# Altium schematic sheet Controller.SchDoc: Schema MPC 555
size A4; Organization1: Sciences of Technology Buchs; Size: A4
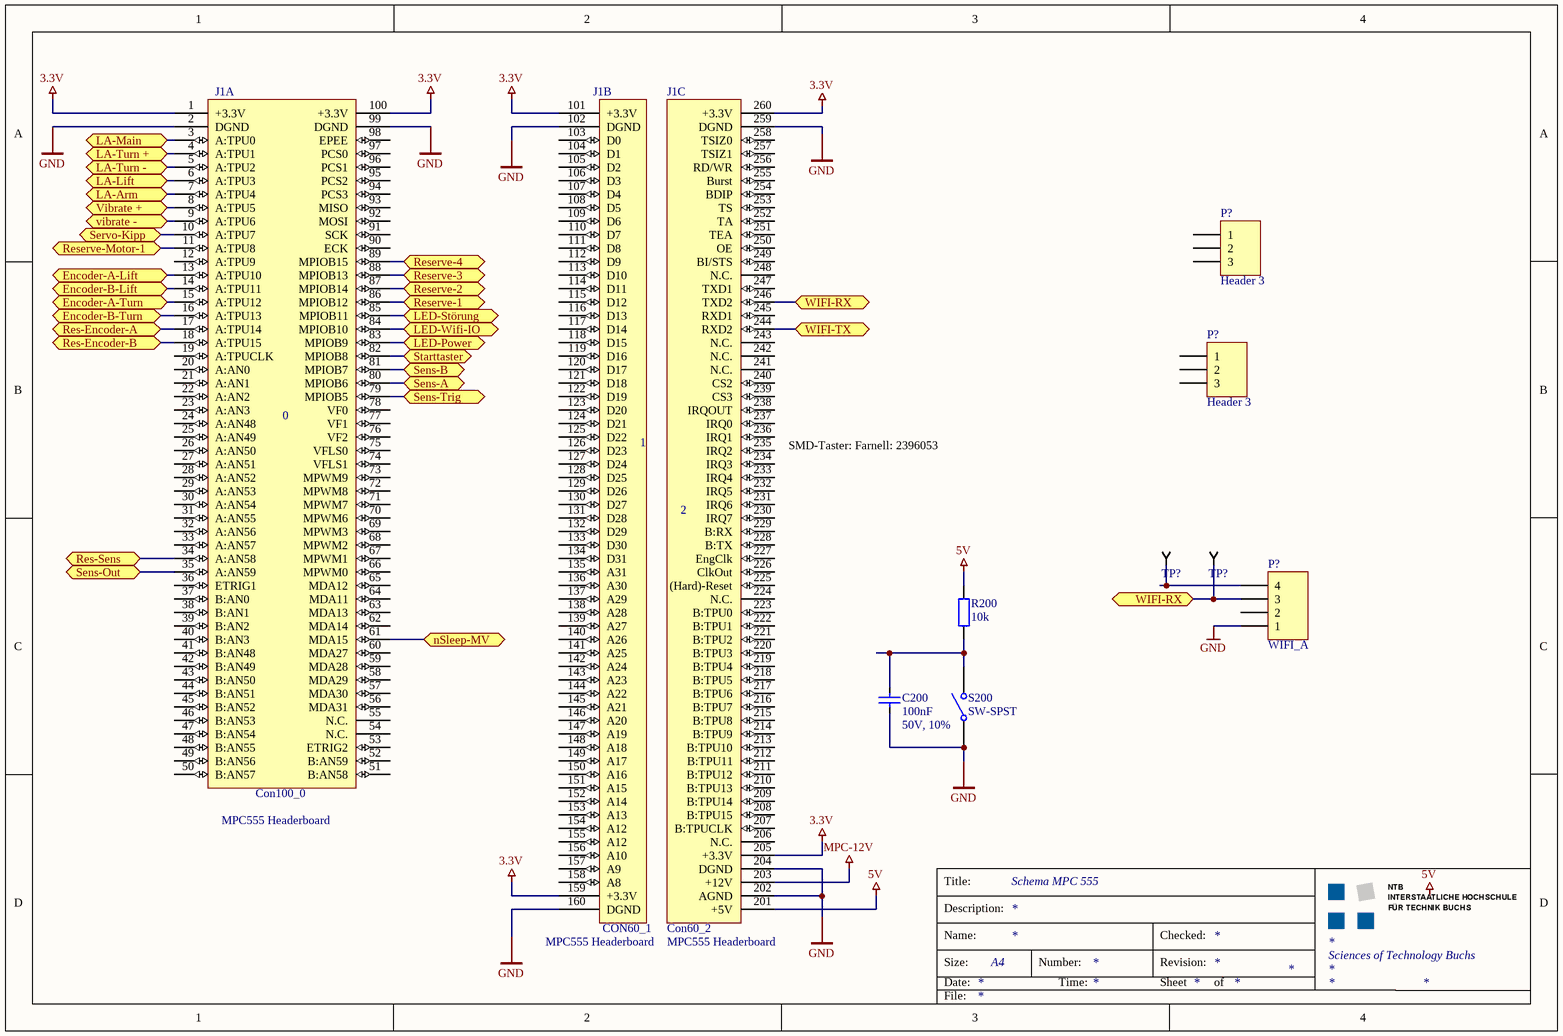
[diagram p0: Controller.SchDoc]

## Parts
(Parts that share a designator on the sheet are numbered #1, #2 ... from top to bottom, then left to right.)
C200  100nF  ValAddon: 50V, 10%  [CAP-0805[2012]]
J1  MPC555 Headerboard  [MPC555 Headerboard THT]  (parts A,B,C of 3)
P?#1  Header 3  [HDR1X3]
P?#2  Header 3  [HDR1X3]
P?#3  WIFI_A  [HDR1X4]
R200  10k  [RES-0805[2012]]
S200  SW-SPST  [B3SE-1002P]
TP?#1  Testpoint SMD 1206  [TP-SMD-1206]  (value not drawn)  (no BOM)
TP?#2  Testpoint SMD 1206  [TP-SMD-1206]  (value not drawn)  (no BOM)

## Ports
Encoder-A-Lift (bidir), Encoder-A-Turn (bidir), Encoder-B-Lift (bidir), Encoder-B-Turn (bidir), LA-Arm (bidir), LA-Lift (bidir), LA-Main (bidir), LA-Turn + (bidir), LA-Turn -, LED-Power (bidir), LED-Störung (bidir), LED-Wifi-IO (bidir), nSleep-MV (bidir), Res-Encoder-A (bidir), Res-Encoder-B (bidir), Res-Sens (bidir), Reserve-1 (bidir), Reserve-2 (bidir), Reserve-3 (bidir), Reserve-4 (bidir), Reserve-Motor-1 (bidir), Sens-A (bidir), Sens-B (bidir), Sens-Out (bidir), Sens-Trig (bidir), Servo-Kipp (bidir), Starttaster (bidir), Vibrate + (bidir), vibrate - (bidir), WIFI-RX (bidir), WIFI-TX (bidir)

## Nets
3.3V: J1.1(+3.3V) J1.100(+3.3V) J1.101(+3.3V) J1.159(+3.3V) J1.205(+3.3V) J1.260(+3.3V)
5V: J1.201(+5V) R200.2
GND: C200.2(Neg) J1.2(DGND) J1.99(DGND) J1.102(DGND) J1.160(DGND) J1.202(AGND) J1.204(DGND) J1.259(DGND) P?#3.1 S200.1(COMMON)
MPC-12V: J1.203(+12V)
Encoder-A-Lift: J1.13(A:TPU10) ; port Encoder-A-Lift
Encoder-A-Turn: J1.15(A:TPU12) ; port Encoder-A-Turn
Encoder-B-Lift: J1.14(A:TPU11) ; port Encoder-B-Lift
Encoder-B-Turn: J1.16(A:TPU13) ; port Encoder-B-Turn
LA-Arm: J1.7(A:TPU4) ; port LA-Arm
LA-Lift: J1.6(A:TPU3) ; port LA-Lift
LA-Main: J1.3(A:TPU0) ; port LA-Main
LA-Turn +: J1.4(A:TPU1) ; port LA-Turn +
LA-Turn -: J1.5(A:TPU2) ; port LA-Turn -
LED-Power: J1.83(MPIOB9) ; port LED-Power
LED-Störung: J1.85(MPIOB11) ; port LED-Störung
LED-Wifi-IO: J1.84(MPIOB10) ; port LED-Wifi-IO
nSleep-MV: J1.61(MDA15) ; port nSleep-MV
Res-Encoder-A: J1.17(A:TPU14) ; port Res-Encoder-A
Res-Encoder-B: J1.18(A:TPU15) ; port Res-Encoder-B
Res-Sens: J1.34(A:AN58) ; port Res-Sens
Reserve-1: J1.86(MPIOB12) ; port Reserve-1
Reserve-2: J1.87(MPIOB14) ; port Reserve-2
Reserve-3: J1.88(MPIOB13) ; port Reserve-3
Reserve-4: J1.89(MPIOB15) ; port Reserve-4
Reserve-Motor-1: J1.11(A:TPU8) ; port Reserve-Motor-1
Sens-A: J1.80(MPIOB6) ; port Sens-A
Sens-B: J1.81(MPIOB7) ; port Sens-B
Sens-Out: J1.35(A:AN59) ; port Sens-Out
Sens-Trig: J1.79(MPIOB5) ; port Sens-Trig
Servo-Kipp: J1.10(A:TPU7) ; port Servo-Kipp
Starttaster: J1.82(MPIOB8) ; port Starttaster
Vibrate +: J1.8(A:TPU5) ; port Vibrate +
vibrate -: J1.9(A:TPU6) ; port vibrate -
WIFI-RX: J1.246(TXD2) P?#3.3 TP?#2.1 ; port WIFI-RX
WIFI-TX: J1.244(RXD2) ; port WIFI-TX
NetC200_1: C200.1(Pos) R200.1 S200.2(NO)
NetP?#3_4: P?#3.4 TP?#1.1

Not connected (* = marked no-connect by the designer): J1 12(A:TPU9) 19(A:TPUCLK) 20(A:AN0) 21(A:AN1) 22(A:AN2) 23(A:AN3) 24(A:AN48) 25(A:AN49) 26(A:AN50) 27(A:AN51) 28(A:AN52) 29(A:AN53) 30(A:AN54) 31(A:AN55) 32(A:AN56) 33(A:AN57) 36(ETRIG1) 37(B:AN0) 38(B:AN1) 39(B:AN2) 40(B:AN3) 41(B:AN48) 42(B:AN49) 43(B:AN50) 44(B:AN51) 45(B:AN52) 46(B:AN53) 47(B:AN54) 48(B:AN55) 49(B:AN56) 50(B:AN57) 51(B:AN58) 52(B:AN59) 53(ETRIG2) 54(N.C.) 55(N.C.) 56(MDA31) 57(MDA30) 58(MDA29) 59(MDA28) 60(MDA27) 62(MDA14) 63(MDA13) 64(MDA11) 65(MDA12) 66(MPWM0) 67(MPWM1) 68(MPWM2) 69(MPWM3) 70(MPWM6) 71(MPWM7) 72(MPWM8) 73(MPWM9) 74(VFLS1) 75(VFLS0) 76(VF2) 77(VF1) 78(VF0) 90(ECK) 91(SCK) 92(MOSI) 93(MISO) 94(PCS3) 95(PCS2) 96(PCS1) 97(PCS0) 98(EPEE) 103(D0) 104(D1) 105(D2) 106(D3) 107(D4) 108(D5) 109(D6) 110(D7) 111(D8) 112(D9) 113(D10) 114(D11) 115(D12) 116(D13) 117(D14) 118(D15) 119(D16) 120(D17) 121(D18) 122(D19) 123(D20) 124(D21) 125(D22) 126(D23) 127(D24) 128(D25) 129(D26) 130(D27) 131(D28) 132(D29) 133(D30) 134(D31) 135(A31) 136(A30) 137(A29) 138(A28) 139(A27) 140(A26) 141(A25) 142(A24) 143(A23) 144(A22) 145(A21) 146(A20) 147(A19) 148(A18) 149(A17) 150(A16) 151(A15) 152(A14) 153(A13) 154(A12) 155(A12) 156(A10) 157(A9) 158(A8) 206(N.C.) 207(B:TPUCLK) 208(B:TPU15) 209(B:TPU14) 210(B:TPU13) 211(B:TPU12) 212(B:TPU11) 213(B:TPU10) 214(B:TPU9) 215(B:TPU8) 216(B:TPU7) 217(B:TPU6) 218(B:TPU5) 219(B:TPU4) 220(B:TPU3) 221(B:TPU2) 222(B:TPU1) 223(B:TPU0) 224(N.C.) 225((Hard)-Reset) 226(ClkOut) 227(EngClk) 228(B:TX) 229(B:RX) 230(IRQ7) 231(IRQ6) 232(IRQ5) 233(IRQ4) 234(IRQ3) 235(IRQ2) 236(IRQ1) 237(IRQ0) 238(IRQOUT) 239(CS3) 240(CS2) 241(N.C.) 242(N.C.) 243(N.C.) 245(RXD1) 247(TXD1) 248(N.C.) 249(BI/STS) 250(OE) 251(TEA) 252(TA) 253(TS) 254(BDIP) 255(Burst) 256(RD/WR) 257(TSIZ1) 258(TSIZ0); P?#1 1 2 3; P?#2 1 2 3; P?#3 2

## Notes on the sheet
- (near J1) SMD-Taster: Farnell: 2396053
- Labels drawn without touching a wire or pin: 5V
- Title:
- Description:
- Size:
- Date:
- Name:
- Number:
- Time:
- Revision:
- Sheet
- Checked:
- of
- File:
- (in symbol MPC555 Headerboard, part A) 0; Con100_0
- (in symbol MPC555 Headerboard, part B) CON60_1
- (in symbol MPC555 Headerboard, part C) Con60_2

## Library data of the parts
C200 = MLCC 0805 100n 50V: 100n 50V X7R MLCC 0805 (1608 Metric); Tolerance: 10%; Case-EIA: 0803; Case-Metric: 2013; Rated Voltage: 50V; Temperature Characteristics EIA: X7R; Temperature Range EIA: -55C/+125C; Value: 100nF
J1 = MPC555 Headerboard: NTB MPC555 Headerboard
P?#1 P?#2 = Header 3: Header, 3-Pin; LatestRevisionDate: 17-Jul-2002; LatestRevisionNote: Re-released for DXP Platform.; Publisher: Altium Limited
P?#3 = Header 4: Header, 4-Pin; LatestRevisionDate: 17-Jul-2002; LatestRevisionNote: Re-released for DXP Platform.; Publisher: Altium Limited
R200 = RES 0805: 0805 (2013 Metric) 1/10 W 10K 1 Thick Film Chip Resistor; Power: 1/10 W; Case-EIA: 0805; Case-Metric: 2013; Tolerance: 1%; Temp. Coefficent: ±100ppm; Technology: SMT; Value: 10k
S200 = SW-SPST: Single-Pole, Single-Throw Switch; Published: 24-Mar-1999; LatestRevisionDate: 17-Jul-2002; LatestRevisionNote: Re-released for DXP Platform.; PackageReference: SPST-2; Publisher: Altium Limited; PackageDescription: Switch; 2 Leads
TP?#1 TP?#2 = Testpoint SMD 1206: Testpoint xSmall; Type: Standard (No BOM)